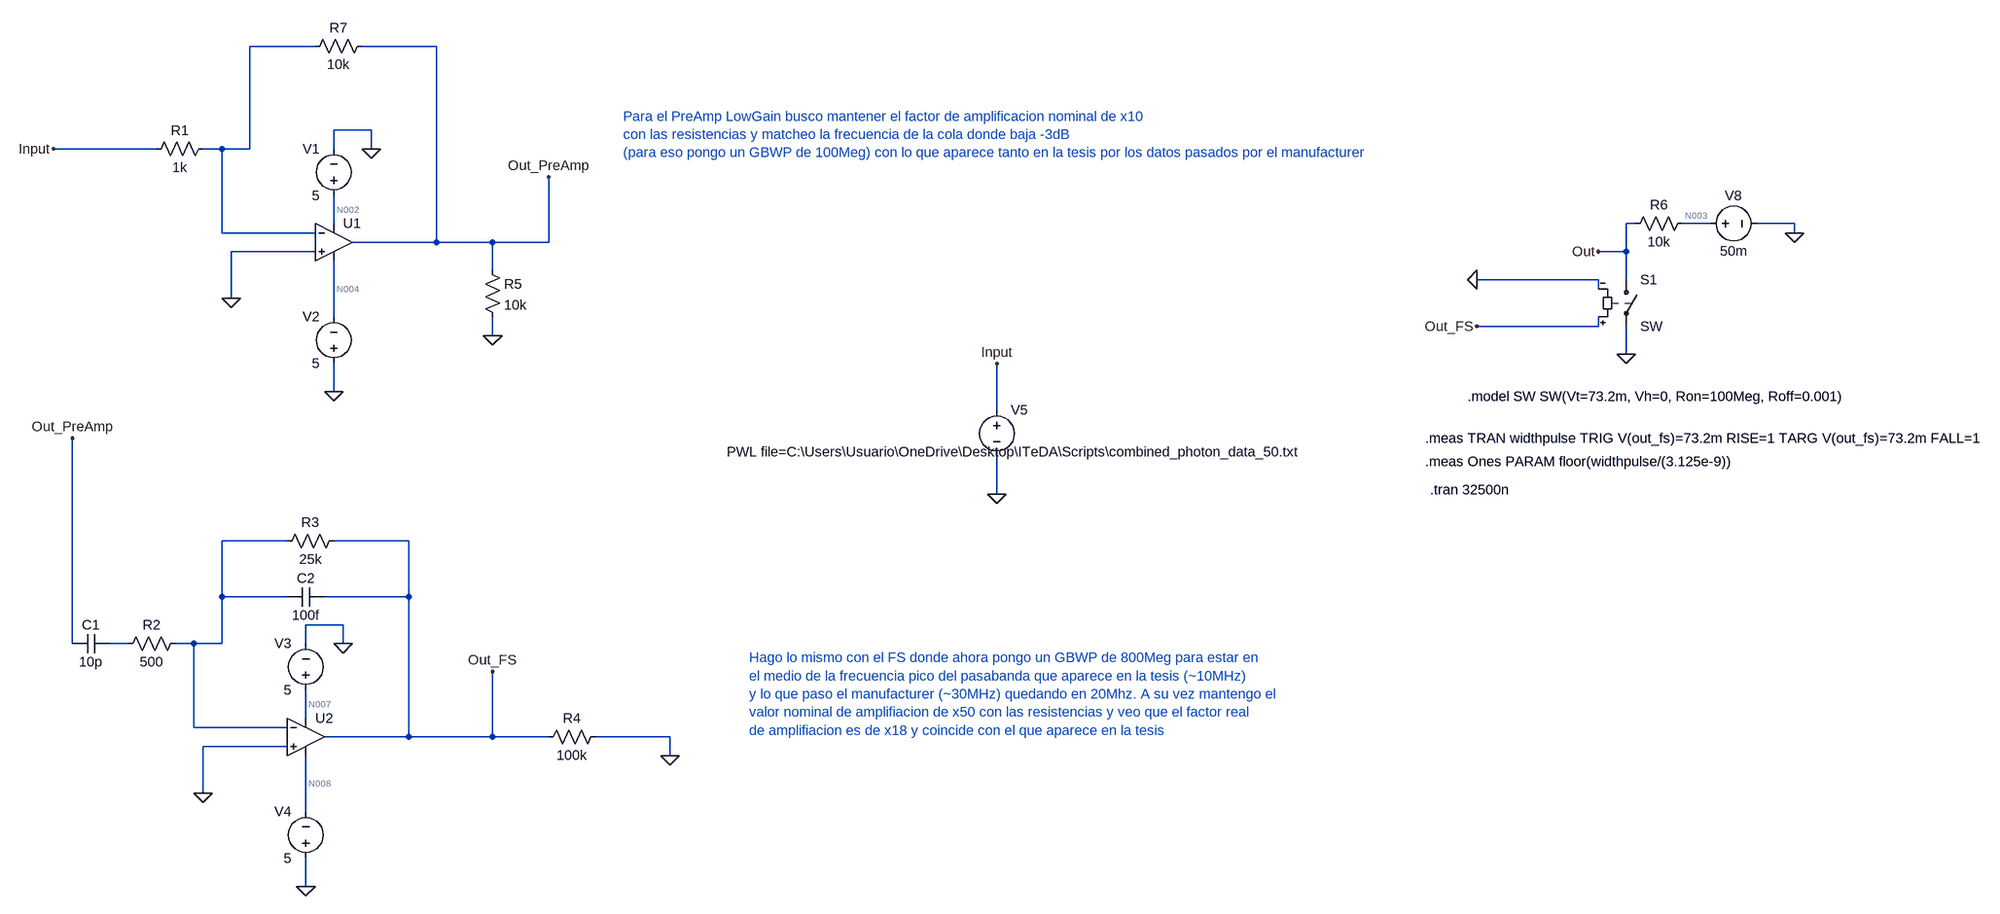
[diagram p0: schematic real_electronic_sim.asc]
real_electronic_sim.asc, the LTspice schematic file:
Version 4
SHEET 1 2372 900
WIRE -1168 -560 -1280 -560
WIRE -960 -560 -1088 -560
WIRE -1072 -416 -1136 -416
WIRE -1440 -384 -1616 -384
WIRE -1328 -384 -1360 -384
WIRE -1280 -384 -1280 -560
WIRE -1280 -384 -1328 -384
WIRE -1136 -384 -1136 -416
WIRE -1072 -384 -1072 -416
WIRE -1136 -256 -1136 -304
WIRE 1216 -256 1200 -256
WIRE 1344 -256 1296 -256
WIRE 1488 -256 1424 -256
WIRE -1328 -240 -1328 -384
WIRE -1168 -240 -1328 -240
WIRE 1488 -240 1488 -256
WIRE -960 -224 -960 -560
WIRE -960 -224 -1104 -224
WIRE -864 -224 -960 -224
WIRE -768 -224 -768 -336
WIRE -768 -224 -864 -224
WIRE -1168 -208 -1312 -208
WIRE 1200 -208 1200 -256
WIRE 1200 -208 1152 -208
WIRE -864 -176 -864 -224
WIRE 1152 -160 944 -160
WIRE 1200 -160 1200 -208
WIRE 1152 -144 1152 -160
WIRE -1312 -128 -1312 -208
WIRE -1136 -96 -1136 -192
WIRE 1152 -80 1152 -96
WIRE 1152 -80 944 -80
WIRE -864 -64 -864 -96
WIRE 1200 -32 1200 -80
WIRE -1136 32 -1136 -16
WIRE 0 64 0 -16
WIRE 0 208 0 144
WIRE -1216 288 -1328 288
WIRE -1008 288 -1136 288
WIRE -1328 384 -1328 288
WIRE -1216 384 -1328 384
WIRE -1008 384 -1008 288
WIRE -1008 384 -1152 384
WIRE -1120 432 -1184 432
WIRE -1584 464 -1584 112
WIRE -1488 464 -1520 464
WIRE -1376 464 -1408 464
WIRE -1328 464 -1328 384
WIRE -1328 464 -1376 464
WIRE -1184 464 -1184 432
WIRE -1120 464 -1120 432
WIRE -1184 592 -1184 544
WIRE -1376 608 -1376 464
WIRE -1216 608 -1376 608
WIRE -1008 624 -1008 384
WIRE -1008 624 -1152 624
WIRE -864 624 -864 512
WIRE -864 624 -1008 624
WIRE -768 624 -864 624
WIRE -560 624 -688 624
WIRE -1216 640 -1360 640
WIRE -560 656 -560 624
WIRE -1360 720 -1360 640
WIRE -1184 752 -1184 656
WIRE -1184 880 -1184 832
FLAG -1136 32 0
FLAG -1072 -384 0
FLAG 0 208 0
FLAG -1312 -128 0
FLAG -1120 464 0
FLAG -1360 720 0
FLAG -768 -336 Out_PreAmp
FLAG -864 512 Out_FS
FLAG -560 656 0
FLAG -1584 112 Out_PreAmp
FLAG 0 -16 Input
FLAG -1616 -384 Input
FLAG -864 -64 0
FLAG 1200 -32 0
FLAG 1488 -240 0
FLAG 1152 -208 Out
FLAG 944 -160 0
FLAG 944 -80 Out_FS
FLAG -1184 880 0
SYMBOL res -1344 -400 R90
WINDOW 0 0 56 VBottom 2
WINDOW 3 32 56 VTop 2
SYMATTR InstName R1
SYMATTR Value 1k
SYMBOL voltage -1136 -288 R180
WINDOW 0 24 96 Left 2
WINDOW 3 24 16 Left 2
WINDOW 123 0 0 Left 0
WINDOW 39 0 0 Left 0
SYMATTR InstName V1
SYMATTR Value 5
SYMBOL voltage -1136 0 R180
WINDOW 0 24 96 Left 2
WINDOW 3 24 16 Left 2
WINDOW 123 0 0 Left 0
WINDOW 39 0 0 Left 0
SYMATTR InstName V2
SYMATTR Value 5
SYMBOL OpAmps\\UniversalOpAmp1 -1136 -224 R0
SYMATTR InstName U1
SYMATTR Value2 Avol=1Meg GBW=100Meg Vos=0
SYMBOL res -1392 448 R90
WINDOW 0 0 56 VBottom 2
WINDOW 3 32 56 VTop 2
SYMATTR InstName R2
SYMATTR Value 500
SYMBOL res -1120 272 R90
WINDOW 0 0 56 VBottom 2
WINDOW 3 32 56 VTop 2
SYMATTR InstName R3
SYMATTR Value 25k
SYMBOL voltage -1184 560 R180
WINDOW 0 24 96 Left 2
WINDOW 3 24 16 Left 2
WINDOW 123 0 0 Left 0
WINDOW 39 0 0 Left 0
SYMATTR InstName V3
SYMATTR Value 5
SYMBOL voltage -1184 848 R180
WINDOW 0 24 96 Left 2
WINDOW 3 24 16 Left 2
WINDOW 123 0 0 Left 0
WINDOW 39 0 0 Left 0
SYMATTR InstName V4
SYMATTR Value 5
SYMBOL OpAmps\\UniversalOpAmp1 -1184 624 R0
SYMATTR InstName U2
SYMATTR Value2 Avol=1Meg GBW=800Meg Vos=0
SYMBOL voltage 0 48 R0
WINDOW 3 -463 87 Left 2
WINDOW 123 0 0 Left 0
WINDOW 39 0 0 Left 0
SYMATTR Value PWL file=C:\Users\Usuario\OneDrive\Desktop\ITeDA\Scripts\combined_photon_data_50.txt
SYMATTR InstName V5
SYMBOL res -672 608 R90
WINDOW 0 0 56 VBottom 2
WINDOW 3 32 56 VTop 2
SYMATTR InstName R4
SYMATTR Value 100k
SYMBOL cap -1520 448 R90
WINDOW 0 0 32 VBottom 2
WINDOW 3 32 32 VTop 2
SYMATTR InstName C1
SYMATTR Value 10p
SYMBOL cap -1152 368 R90
WINDOW 0 0 32 VBottom 2
WINDOW 3 32 32 VTop 2
SYMATTR InstName C2
SYMATTR Value 100f
SYMBOL res -880 -192 R0
SYMATTR InstName R5
SYMATTR Value 10k
SYMBOL sw 1200 -176 R0
SYMATTR InstName S1
SYMBOL voltage 1328 -256 R270
WINDOW 0 32 56 VTop 2
WINDOW 3 -32 56 VBottom 2
SYMATTR InstName V8
SYMATTR Value 50m
SYMBOL res 1312 -272 R90
WINDOW 0 0 56 VBottom 2
WINDOW 3 32 56 VTop 2
SYMATTR InstName R6
SYMATTR Value 10k
SYMBOL res -1072 -576 R90
WINDOW 0 0 56 VBottom 2
WINDOW 3 32 56 VTop 2
SYMATTR InstName R7
SYMATTR Value 10k
TEXT 864 200 Left 2 !.tran 32500n
TEXT -640 -440 Left 2 ;Para el PreAmp LowGain busco mantener el factor de amplificacion nominal de x10 \ncon las resistencias y matcheo la frecuencia de la cola donde baja -3dB \n(para eso pongo un GBWP de 100Meg) con lo que aparece tanto en la tesis por los datos pasados por el manufacturer
TEXT -424 488 Left 2 ;Hago lo mismo con el FS donde ahora pongo un GBWP de 800Meg para estar en \nel medio de la frecuencia pico del pasabanda que aparece en la tesis (~10MHz)\ny lo que paso el manufacturer (~30MHz) quedando en 20Mhz. A su vez mantengo el \nvalor nominal de amplifiacion de x50 con las resistencias y veo que el factor real\nde amplifiacion es de x18 y coincide con el que aparece en la tesis
TEXT 928 40 Left 2 !.model SW SW(Vt=73.2m, Vh=0, Ron=100Meg, Roff=0.001)
TEXT 856 152 Left 2 !.meas Ones PARAM floor(widthpulse/(3.125e-9))
TEXT 856 112 Left 2 !.meas TRAN widthpulse TRIG V(out_fs)=73.2m RISE=1 TARG V(out_fs)=73.2m FALL=1

The netlist it stands for:
* real_electronic_sim.asc
R1 N001 Input 1k
V1 N002 0 5
V2 0 N004 5
XU1 0 N001 N002 N004 Out_PreAmp level1 Avol=1Meg GBW=100Meg Vos=0 En=0 Enk=0 In=0 Ink=0 Rin=500Meg  ; pins In+ In- V+ V- OUT
R2 N005 N006 500
R3 Out_FS N005 25k
V3 N007 0 5
V4 0 N008 5
XU2 0 N005 N007 N008 Out_FS level1 Avol=1Meg GBW=800Meg Vos=0 En=0 Enk=0 In=0 Ink=0 Rin=500Meg  ; pins In+ In- V+ V- OUT
V5 Input 0 PWL file=C:\Users\Usuario\OneDrive\Desktop\ITeDA\Scripts\combined_photon_data_50.txt
R4 0 Out_FS 100k
C1 N006 Out_PreAmp 10p
C2 Out_FS N005 100f
R5 Out_PreAmp 0 10k
S1 Out 0 Out_FS 0 SW
V8 N003 0 50m
R6 N003 Out 10k
R7 Out_PreAmp N001 10k
.tran 32500n
* Para el PreAmp LowGain busco mantener el factor de amplificacion nominal de x10
* con las resistencias y matcheo la frecuencia de la cola donde baja -3dB
* (para eso pongo un GBWP de 100Meg) con lo que aparece tanto en la tesis por los datos pasados por el manufacturer
* Hago lo mismo con el FS donde ahora pongo un GBWP de 800Meg para estar en
* el medio de la frecuencia pico del pasabanda que aparece en la tesis (~10MHz)
* y lo que paso el manufacturer (~30MHz) quedando en 20Mhz. A su vez mantengo el
* valor nominal de amplifiacion de x50 con las resistencias y veo que el factor real
* de amplifiacion es de x18 y coincide con el que aparece en la tesis
.model SW SW(Vt=73.2m, Vh=0, Ron=100Meg, Roff=0.001)
.meas Ones PARAM floor(widthpulse/(3.125e-9))
.meas TRAN widthpulse TRIG V(out_fs)=73.2m RISE=1 TARG V(out_fs)=73.2m FALL=1
.lib UniversalOpAmp1.lib
.backanno
.end

* Results of the author's LTspice run, read from the files saved beside the schematic
* Operating Point, zero values left out:
*   V(n002) = 5 V
*   V(n004) = -5 V
*   V(n007) = 5 V
*   V(n008) = -5 V
*   V(n003) = 50 mV
*   I(R6) = 5 µA
*   I(S1) = -5 µA
*   I(V1) = -10 nA
*   I(V2) = -10 nA
*   I(V3) = -10 nA
*   I(V4) = -10 nA
*   I(V8) = -5 µA
*   Ix(u1:3) = 10 nA
*   Ix(u1:4) = -10 nA
*   Ix(u2:3) = 10 nA
*   Ix(u2:4) = -10 nA
* From the log:
*   ones: floor(widthpulse/(3.125e-9))=2
*   widthpulse=6.89099e-09 FROM 1.31859e-06 TO 1.32548e-06